# EAGLE design powercontrol (EAGLE 9.5.1)
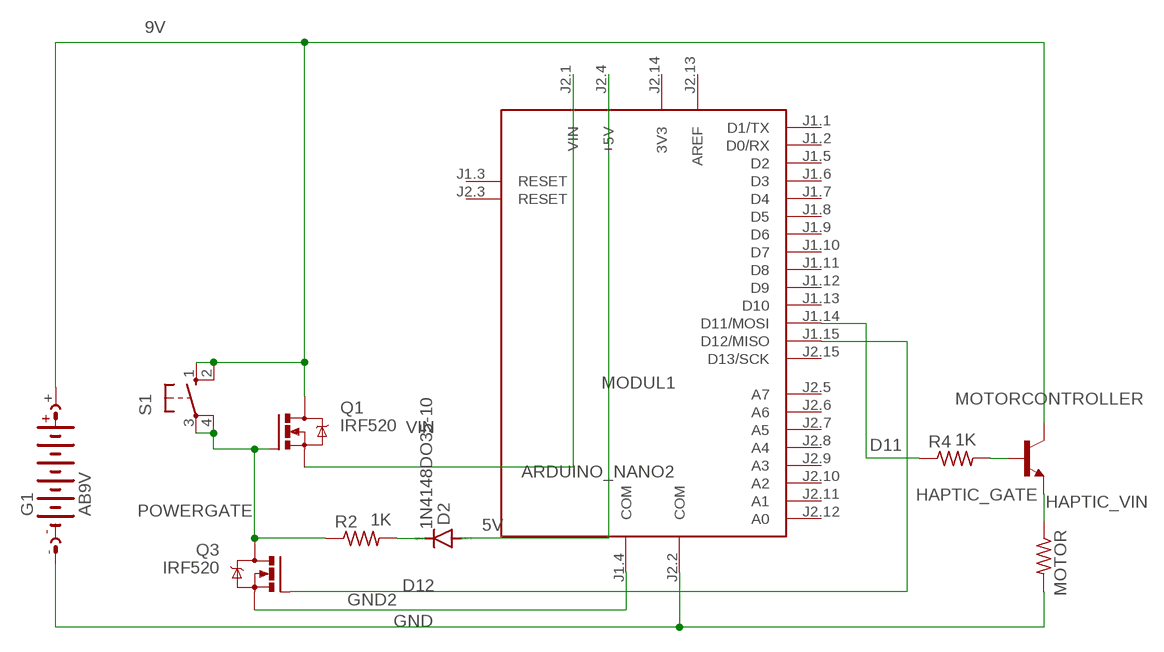
[diagram p0: schematic, sheet 1]

## Parts
D2  1N4148DO35-10  [DO35-10]
G1  AB9V  [AB9V]
MODUL1  ARDUINO_NANO2  [ARDUINO_NANO2]
MOTOR  1K  R-US_0204/7  [0204/7]
MOTORCONTROLLER  2N2222-NPN-TO92-EBC  [TO92-EBC]
Q1  IRF520  [TO220BV]
Q3  IRF520  [TO220BV]
R2  1K  R-US_0204/7  [0204/7]
R4  1K  R-US_0204/7  [0204/7]
S1  10-XX  [B3F-10XX]

## Nets
5V: D2.A MODUL1.J2.4(+5V)
9V: G1.+ MOTORCONTROLLER.C Q1.D S1.1(S) S1.2(S1)
D11: MODUL1.J1.14(D11/MOSI) R4.1
D12: MODUL1.J1.15(D12/MISO) Q3.G
DIODE_TO_RESISTOR: D2.C R2.2
GND: G1.- MODUL1.J2.2(COM) MOTOR.2
GND2: MODUL1.J1.4(COM) Q3.S
HAPTIC_GATE: MOTORCONTROLLER.B R4.2
HAPTIC_VIN: MOTOR.1 MOTORCONTROLLER.E
POWERGATE: Q1.G Q3.D R2.1 S1.3(P) S1.4(P1)
VIN: MODUL1.J2.1(VIN) Q1.S
Unconnected: MODUL1.J1.1(D1/TX) MODUL1.J1.2(D0/RX) MODUL1.J1.3(RESET) MODUL1.J1.5(D2) MODUL1.J1.6(D3) MODUL1.J1.7(D4) MODUL1.J1.8(D5) MODUL1.J1.9(D6) MODUL1.J1.10(D7) MODUL1.J1.11(D8) MODUL1.J1.12(D9) MODUL1.J1.13(D10) MODUL1.J2.3(RESET) MODUL1.J2.5(A7) MODUL1.J2.6(A6) MODUL1.J2.7(A5) MODUL1.J2.8(A4) MODUL1.J2.9(A3) MODUL1.J2.10(A2) MODUL1.J2.11(A1) MODUL1.J2.12(A0) MODUL1.J2.15(D13/SCK)

## Power pins joined to a net without a drawn wire
3V3: MODUL1.J2.14(3V3)
AREF: MODUL1.J2.13(AREF)

## Library data of the parts
D2 = diode:1N4148: DIODE high speed (Philips)
G1 = battery:AB9V: 9-V BATTERY CLIP
MODUL1 = arduino:ARDUINO_NANO2: Arduino Nano2 Auto generated by modulcreator.ulp \;; ANZAHL: 2; MODUL: TRUE; STECKX0: -76200; STECKX1: 76200; STECKY0: 177800; STECKY1: 177800
MOTOR R2 R4 = rcl:R-US_: RESISTOR, American symbol; SPICEPREFIX: R
MOTORCONTROLLER = transistor-neu-to92:*-NPN-: NPN Transistror
Q1 Q3 = transistor-power:IRF520: HEXFET Power MOSFET
S1 = switch-omron:10-XX: OMRON SWITCH; MPN: B3F-1000; OC_FARNELL: 176432; OC_NEWARK: 36M3542

## Board
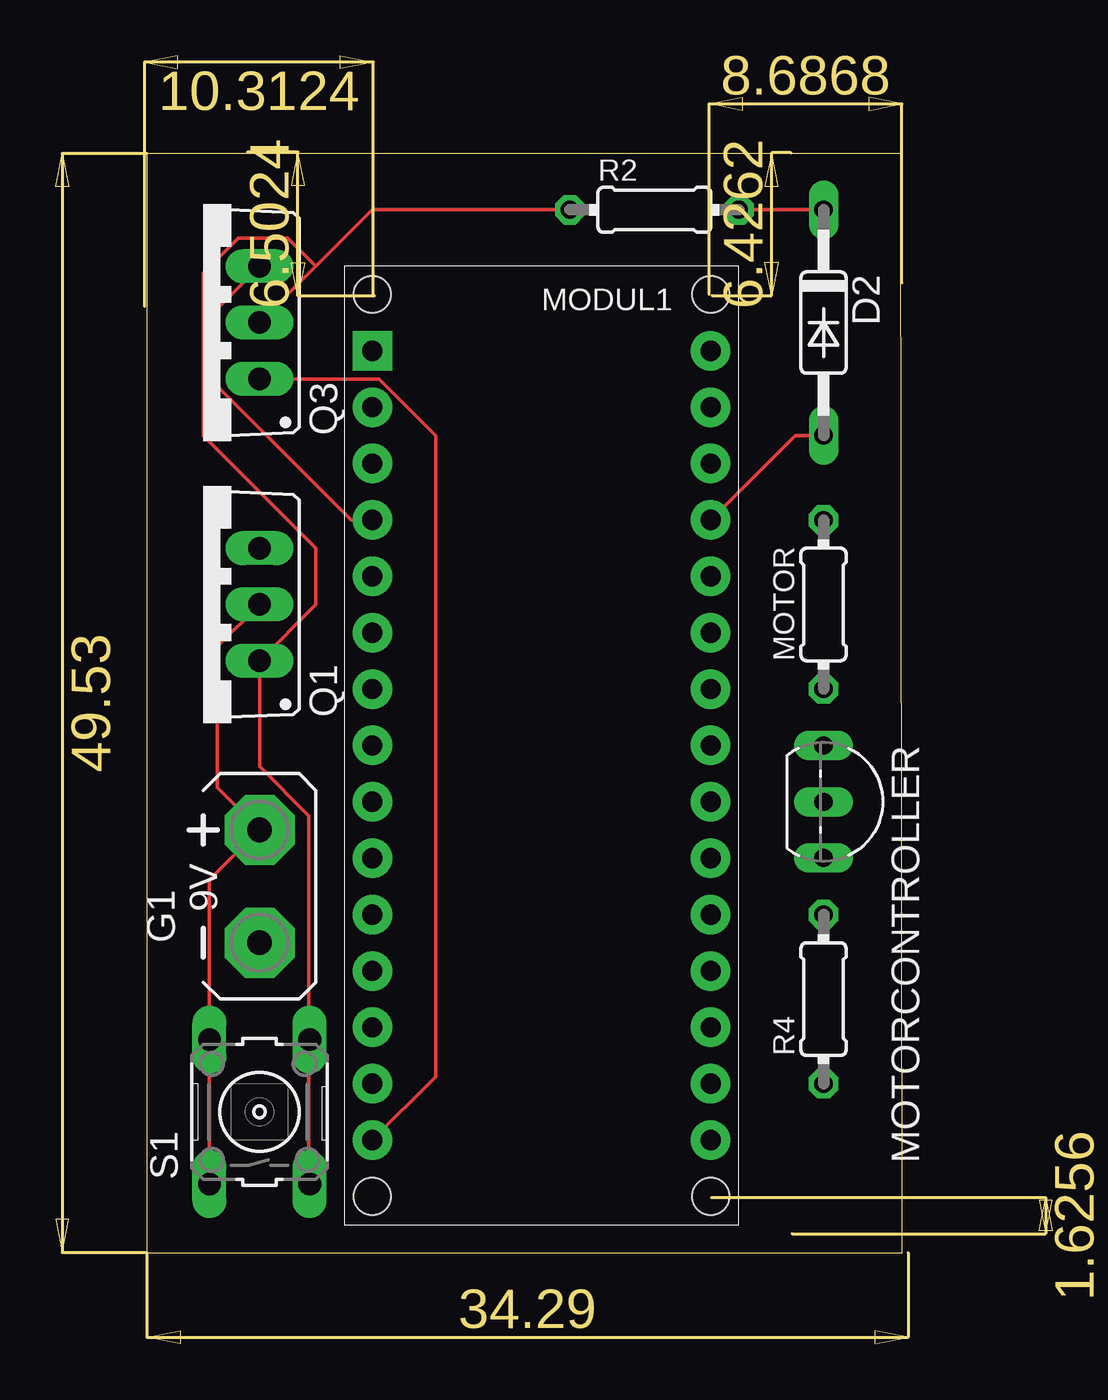
[diagram p1: board, top side]
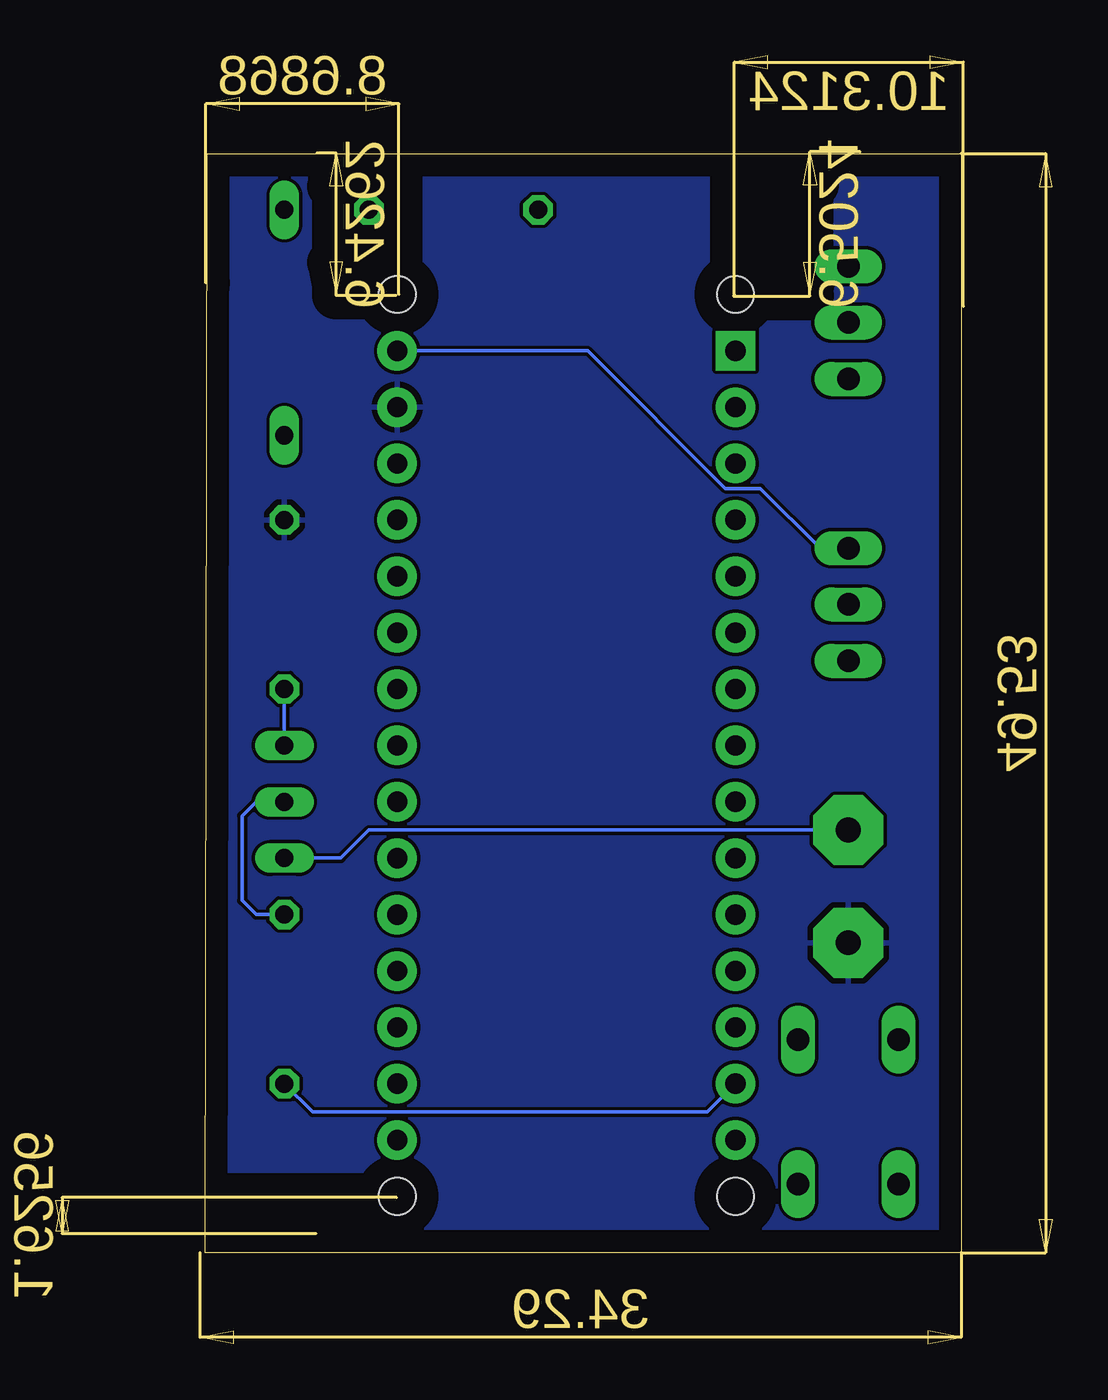
[diagram p2: board, bottom side, seen from below]

Size 34.04 x 49.52 mm. Coordinates in mm from the lower left corner, seen from the top.
Outline: 0,0 34.04,0 33.96,49.52 0,49.52 0,0
Copper layers (1*16): Top 0.035mm / dielectric 1.5mm / Bottom 0.035mm
Design rules "default": minimum track width 6mil, minimum drill 0.35mm, track to track 6mil, track to pad 6mil, pad to pad 6mil, via to via 6mil, smd to smd 6mil, copper to edge 40mil, drill to drill 6mil, minimum pad ring 10mil, minimum via ring 8mil, stop-mask expansion 4mil, vias tented up to drill 0mil, thermal gap 10mil

### Footprints (pad centres in the part's own frame; a part is rotated, then mirrored left to right if it is on the bottom)
DO35-10 = drill 0.813 long: A 5.08,0; C -5.08,0
AB9V = drill 1.118 pad 3.15 octagon: + 0,2.54; - 0,-2.54
ARDUINO_NANO2 = drill 0.914 pad 1.778 square: J1.1 -7.62,17.78 | drill 0.914 pad 1.778: J1.2 -7.62,15.24; J1.3 -7.62,12.7; J1.4 -7.62,10.16; J1.5 -7.62,7.62; J1.6 -7.62,5.08; J1.7 -7.62,2.54; J1.8 -7.62,0; J1.9 -7.62,-2.54; J1.10 -7.62,-5.08; J1.11 -7.62,-7.62; J1.12 -7.62,-10.16; J1.13 -7.62,-12.7; J1.14 -7.62,-15.24; J1.15 -7.62,-17.78; J2.1 7.62,17.78; J2.2 7.62,15.24; J2.3 7.62,12.7; J2.4 7.62,10.16; J2.5 7.62,7.62; J2.6 7.62,5.08; J2.7 7.62,2.54; J2.8 7.62,0; J2.9 7.62,-2.54; J2.10 7.62,-5.08; J2.11 7.62,-7.62; J2.12 7.62,-10.16; J2.13 7.62,-12.7; J2.14 7.62,-15.24; J2.15 7.62,-17.78 | hole 1.651: -7.62,-20.32; 7.62,-20.32; 7.62,20.32; -7.62,20.32
0204/7 = drill 0.813 octagon: 1 -3.81,0; 2 3.81,0
TO92-EBC = drill 0.813 long: B 0,-1.27; C 2.54,-1.27; E -2.54,-1.27
TO220BV = drill 1.016 long: D 0,-2.54; G -2.54,-2.54; S 2.54,-2.54
B3F-10XX = drill 1.016 long: 1 -3.251,2.261; 2 3.251,2.261; 3 -3.251,-2.261; 4 3.251,-2.261

### Placement (x,y rotation side)
D2  30.48,41.91 270 top
G1  5.08,16.51 0 top
MODUL1  17.78,22.86 0 top
MOTOR  30.48,29.21 90 top
MOTORCONTROLLER  31.75,20.32 270 top
Q1  2.54,29.21 90 top
Q3  2.54,41.91 90 top
R2  22.86,46.99 0 top
R4  30.48,11.43 90 top
S1  5.08,6.35 90 top

### Tracks (layer width: path | path; a pad name or v marks a point on that pad's centre or on a via)
5V
  Top 0.152: D2.A 29.21,36.83 MODUL1.J2.4
9V
  Top 0.152: Q1.D 3.18,27.3 3.18,20.95 G1.+ 2.82,16.79 S1.2 S1.1
  Bottom 0.152: MOTORCONTROLLER.C 27.94,17.78 26.67,19.05 G1.+
D11
  Bottom 0.152: R4.1 29.21,6.35 11.43,6.35 MODUL1.J1.14
D12
  Top 0.152: Q3.G 10.48,39.37 13.02,36.83 13.02,7.94 MODUL1.J1.15
DIODE_TO_RESISTOR
  Top 0.152: D2.C R2.2
GND
  pour Bottom: 34.29,49.53 0,49.53 0,0 34.29,0
GND2
  Top 0.152: Q3.S 3.18,42.55 3.18,39.05 9.21,33.02 MODUL1.J1.4
HAPTIC_GATE
  Bottom 0.152: MOTORCONTROLLER.B 31.75,20.32 32.39,19.69 32.39,15.88 31.75,15.24 R4.2
HAPTIC_VIN
  Bottom 0.152: MOTOR.1 MOTORCONTROLLER.E
POWERGATE
  Top 0.152: R2.1 10.16,46.99 7.62,44.45 | Q3.D 7.62,44.45 | S1.3 7.3,3.17 7.3,9.52 S1.4 7.3,9.84 7.3,19.69 5.08,21.91 Q1.G 7.62,29.21 7.62,31.75 2.54,36.83 2.54,44.13 4.13,45.72 6.35,45.72 7.62,44.45
VIN
  Bottom 0.152: MODUL1.J2.1 16.82,40.64 10.62,34.44 9.04,34.44 6.35,31.75 Q1.S

### Text on the board
tValues: Smart Gym Node